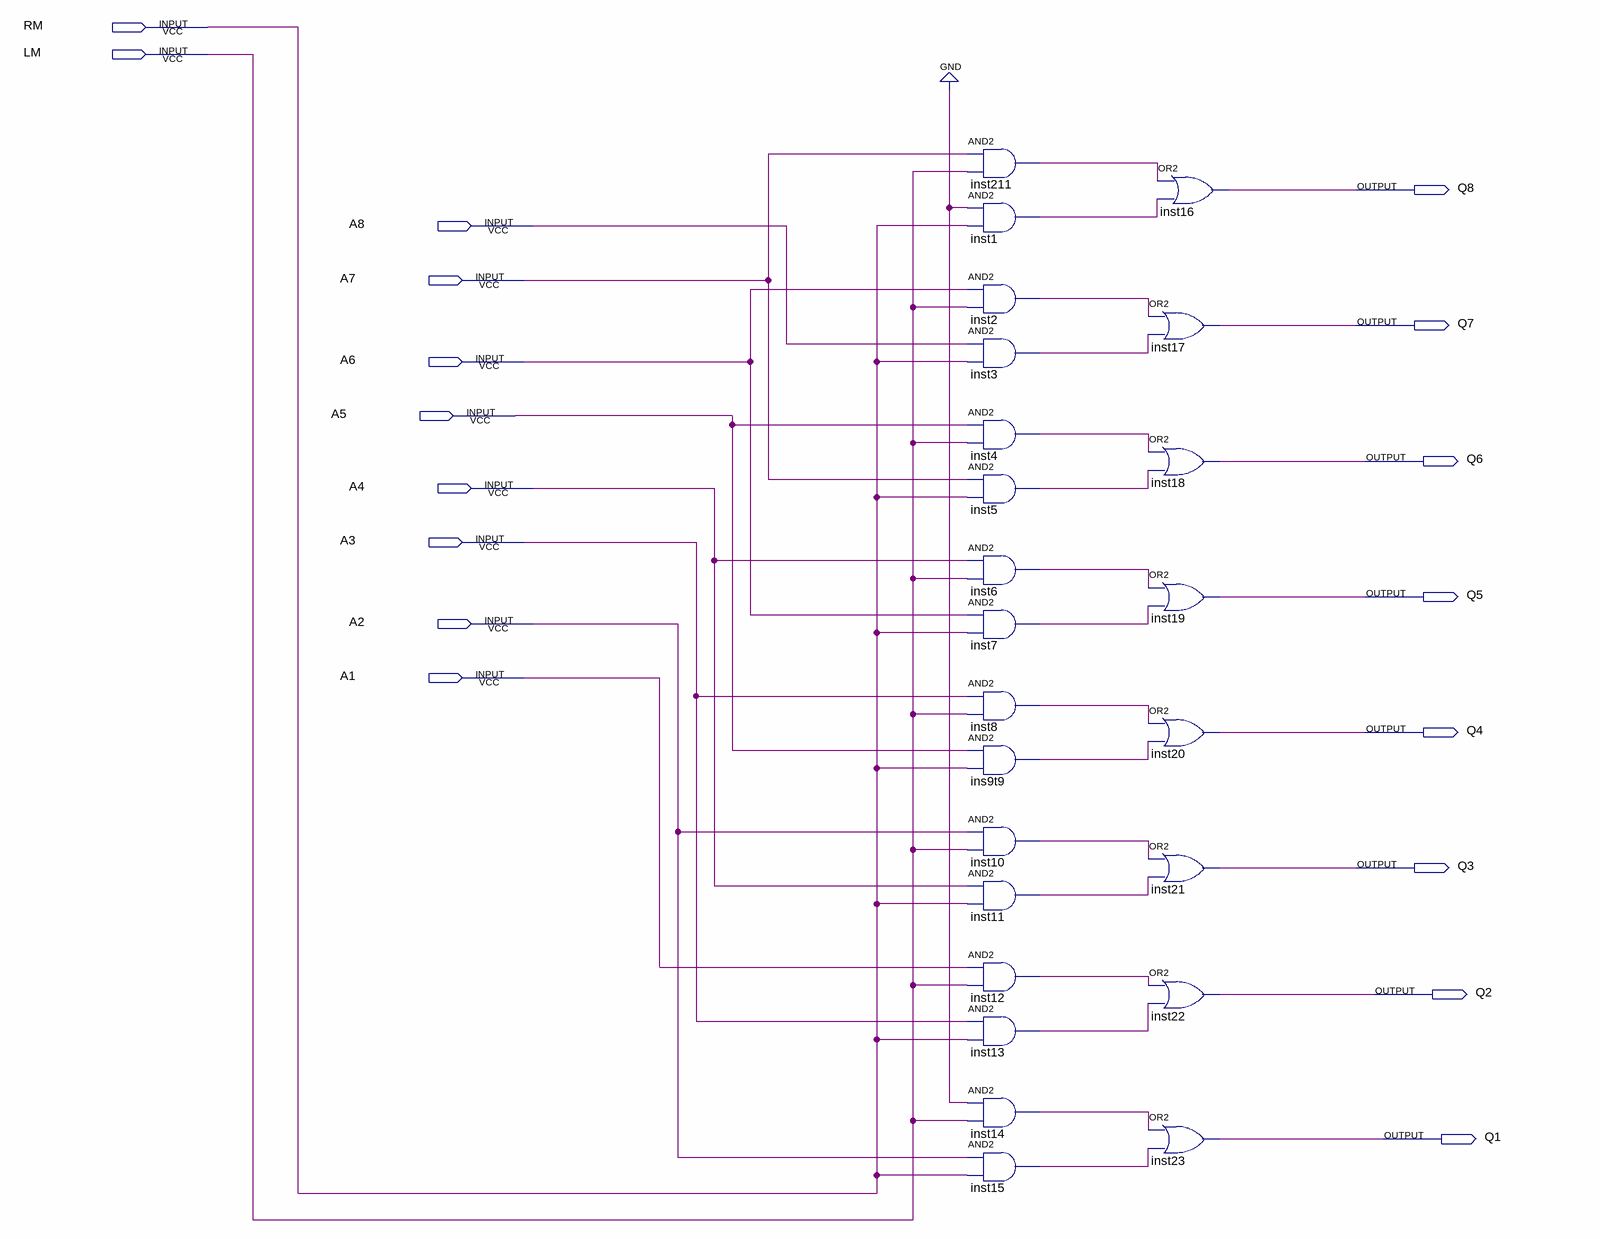
[diagram p0: schematic sheet]
// Quartus schematic shifter.bdf as structural Verilog: 24 symbols, 18 pins
module shifter (
  input  RM,
  input  LM,
  input  A8,
  input  A7,
  input  A6,
  input  A5,
  input  A4,
  input  A3,
  input  A2,
  input  A1,
  output Q8,
  output Q7,
  output Q6,
  output Q5,
  output Q4,
  output Q3,
  output Q2,
  output Q1
);

  wire ins9t9_out, inst1_out, inst2_out, inst3_out, inst4_out, inst5_out, inst6_out, inst7_out, inst8_out,
       inst10_out, inst11_out, inst12_out, inst13_out, inst14_out, inst15_out, inst211_out;

  and inst211 (inst211_out, A7, LM);
  and inst1 (inst1_out, 1'b0, RM);
  and inst2 (inst2_out, A6, LM);
  and inst3 (inst3_out, A8, RM);
  and inst4 (inst4_out, A5, LM);
  and inst5 (inst5_out, A7, RM);
  and inst6 (inst6_out, A4, LM);
  and inst7 (inst7_out, A6, RM);
  and inst8 (inst8_out, A3, LM);
  and ins9t9 (ins9t9_out, A5, RM);
  and inst10 (inst10_out, A2, LM);
  and inst11 (inst11_out, A4, RM);
  and inst12 (inst12_out, A1, LM);
  and inst13 (inst13_out, A3, RM);
  and inst14 (inst14_out, 1'b0, LM);
  and inst15 (inst15_out, A2, RM);
  or inst16 (Q8, inst211_out, inst1_out);
  or inst17 (Q7, inst2_out, inst3_out);
  or inst18 (Q6, inst4_out, inst5_out);
  or inst19 (Q5, inst6_out, inst7_out);
  or inst20 (Q4, inst8_out, ins9t9_out);
  or inst21 (Q3, inst10_out, inst11_out);
  or inst22 (Q2, inst12_out, inst13_out);
  or inst23 (Q1, inst14_out, inst15_out);
endmodule
